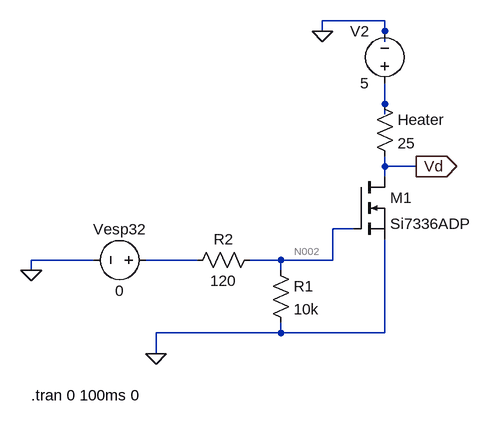
[diagram p0: schematic heating_test.asc]
heating_test.asc, the LTspice schematic file:
Version 4
SHEET 1 880 680
WIRE 496 -768 400 -768
WIRE 400 -752 400 -768
WIRE 496 -752 496 -768
WIRE 496 -736 496 -752
WIRE 496 -640 496 -672
WIRE 496 -624 496 -640
WIRE 496 -544 496 -560
WIRE 544 -544 496 -544
WIRE 496 -528 496 -544
WIRE 448 -448 416 -448
WIRE 48 -400 -48 -400
WIRE 208 -400 128 -400
WIRE 336 -400 288 -400
WIRE 416 -400 416 -448
WIRE 416 -400 336 -400
WIRE -48 -384 -48 -400
WIRE 336 -384 336 -400
WIRE 336 -288 336 -304
WIRE 336 -288 144 -288
WIRE 496 -288 496 -432
WIRE 496 -288 336 -288
WIRE 144 -256 144 -288
FLAG 144 -256 0
FLAG -48 -384 0
FLAG 400 -752 0
FLAG 544 -544 Vd
IOPIN 544 -544 Out
SYMBOL res 320 -400 R0
SYMATTR InstName R1
SYMATTR Value 10k
SYMBOL res 304 -416 R90
WINDOW 0 0 56 VBottom 2
WINDOW 3 32 56 VTop 2
SYMATTR InstName R2
SYMATTR Value 120
SYMBOL voltage 144 -400 R90
WINDOW 0 -32 56 VBottom 2
WINDOW 3 32 56 VTop 2
WINDOW 123 0 0 Left 0
WINDOW 39 0 0 Left 0
SYMATTR InstName Vesp32
SYMATTR Value 0
SYMBOL nmos 448 -528 R0
SYMATTR InstName M1
SYMATTR Value Si7336ADP
SYMBOL res 480 -656 R0
SYMATTR InstName Heater
SYMATTR Value 25
SYMBOL voltage 496 -656 R180
WINDOW 0 24 96 Left 2
WINDOW 3 24 16 Left 2
WINDOW 123 0 0 Left 0
WINDOW 39 0 0 Left 0
SYMATTR InstName V2
SYMATTR Value 5
TEXT -48 -192 Left 2 !.tran 0 100ms 0

The netlist it stands for:
* heating_test.asc
R1 N002 0 10k
R2 N002 N003 120
Vesp32 N003 0 0
M1 Vd N002 0 0 Si7336ADP
R§Heater N001 Vd 25
V2 N001 0 5
.model NMOS NMOS
.model PMOS PMOS
.lib standard.mos
.tran 0 100ms 0
.backanno
.end

* Results of the author's LTspice run, read from the files saved beside the schematic
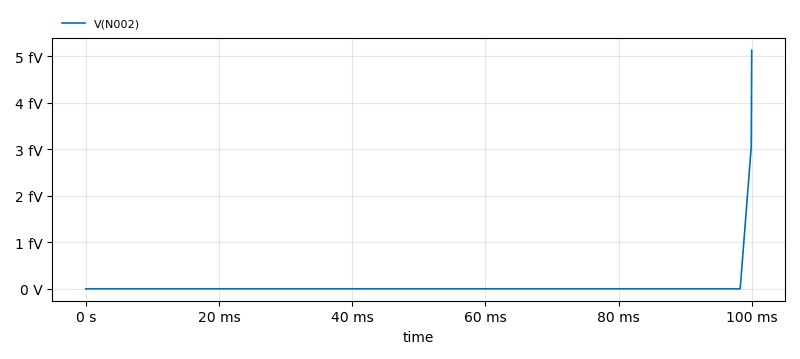
[diagram p1: Transient Analysis of heating_test.asc, plotted from the saved traces]
* Transient Analysis, 1 run:
*   V(N002): min -8.47e-06 fV, max 5.122 fV, average 0.0281 fV, rms 0.299 fV, last 5.122 fV